# Altium schematic sheet Misc.SchDoc
size A4
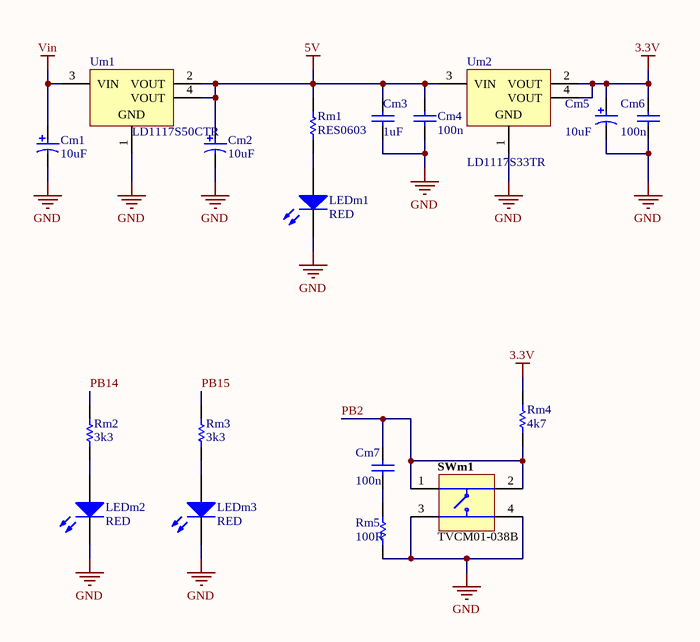
[diagram p0: Misc.SchDoc]

## Parts
Cm1  10uF  [CAPMP3217X18-T_V]
Cm2  10uF  [CAPMP3217X18-T_V]
Cm3  1uF  [CAPC0603(1608)100_L]
Cm4  100n  [CAPC0603(1608)100_L]
Cm5  10uF  [CAPMP3217X18-T_V]
Cm6  100n  [CAPC0603(1608)100_L]
Cm7  100n  [CAPC0603(1608)100_L]
LEDm1  RED  [0805_DIODE]
LEDm2  RED  [0805_DIODE]
LEDm3  RED  [0805_DIODE]
Rm1  RES0603  [RESC0603(1608)_L]
Rm2  3k3  [RESC0603(1608)_L]
Rm3  3k3  [RESC0603(1608)_L]
Rm4  4k7  [RESC0603(1608)_L]
Rm5  100R  [RESC0603(1608)_L]
SWm1  TVCM01-038B  [JNFU-TVCM01-038B_V]
Um1  LD1117S50CTR  [SOT-223_N]
Um2  LD1117S33TR  [SOT-223_L]

## Nets
3.3V: Cm5.1 Cm6.2 Rm4.2 Um2.2(VOUT) Um2.4(VOUT)
5V: Cm2.1 Cm3.2 Cm4.2 Rm1.2 Um1.2(VOUT) Um1.4(VOUT) Um2.3(VIN)
GND: Cm1.2 Cm2.2 Cm3.1 Cm4.1 Cm5.2 Cm6.1 LEDm1.2(K) LEDm2.2(K) LEDm3.2(K) Rm5.1 SWm1.3 SWm1.4 Um1.1(GND) Um2.1(GND)
Vin: Cm1.1 Um1.3(VIN)
PB2: Cm7.2 Rm4.1 SWm1.1 SWm1.2
PB14: Rm2.2
PB15: Rm3.2
NetCm7_1: Cm7.1 Rm5.2
NetLEDm1_1: LEDm1.1(A) Rm1.1
NetLEDm2_1: LEDm2.1(A) Rm2.1
NetLEDm3_1: LEDm3.1(A) Rm3.1

## Library data of the parts
Cm1 Cm2 Cm5 = CMP-1661-00003-1: Standard Tantalum, 1 uF, +/- 10%, 35 V, -55 to 125 degC, 2-Pin SMD (1206), RoHS, Tape and Reel; Current Rating: 200 mA; Voltage Rating (DC): 30 V; REACH SVHC: No SVHC; ComponentLink2URL: http://datasheets.avx.com/TAJ.pdf; Pins: 3; PackageReference: CAPMP3217X18-T; Width: 4 mm; ComponentLink3Description: Package Specification; Length: 11.6 mm; PackageDescription: 2-Pin Surface Mount Device, Body 3.2 x 1.65 mm; ComponentLink2Description: Datasheet; Max Operating Temperature: 70 degC; Contact Material: Copper; Contact Finish: Silver; DatasheetVersion: Feb-16; Contact Plating: Silver; Package Quantity: 1000; Height: 7.4 mm; Min Operating Temperature: -20 degC; Packaging: Bulk; RoHSCompliant: true; ComponentLink1URL: http://www.avx.com/; Mount: Through Hole; ComponentLink1Description: Manufacturer URL; ComponentLink3URL: http://www.avx.com/download/software/literature/AVX-Footprint-Library.pdf
Cm3 Cm4 Cm6 Cm7 = CMP-1590-00005-1: 0603 (1608 Metric) Chip Capacitor; Case-Metric: 1608; Case-EIA: 0603; PackageReference: CAPC0603(1608)100
LEDm1-LEDm3 = LED: Light-emitting diode; COLOR: RED
Rm1-Rm5 = CMP-1591-00001-1: 0603 (1608 Metric) Chip Resistor; Case-Metric: 1608; Case-EIA: 0603; PackageReference: RESC0603(1608)
SWm1 = CMP-0224-00001-1: Switch, Push Button, 50 mA, 12V DC, SMD; Mechanical Life: 100,000 cycles; PackageReference: TVCM01-038B; Operating Temperature: -30 to 85 degC; ComponentLink1URL: http://www.jian-fu.com/; ComponentLink2Description: Datasheet; Mounting Technology: Suface Mount; Case Size: 4.5 x 4.5; ComponentLink1Description: Manufacturer URL; PartNumber: TVCM01-038B; ComponentLink2URL: http://www.jian-fu.com/product-61.html; PackageDescription: 4-Pin Surface Mount Switch, 4.5 x 4.5 mm Body
Um1 = CMP-0244-00311-1: Fixed Low Drop Positive Voltage Regulator, 5V, 4-Pin SOT-223, Tape and Reel; PackageReference: SOT-223; PackageVersion: 2010; ComponentLink2URL: http://www.st.com/internet/com/TECHNICAL_RESOURCES/TECHNICAL_LITERATURE/DATASHEET/CD00000544.pdf; ComponentLink1URL: http://www.st.com; ComponentLink2Description: Datasheet; DatasheetVersion: 1/11/2011; ComponentLink1Description: Manufacturer URL; PackageDescription: 4-Pin SOT-223 Package, 6.5 x 3.5 mm Body, 2.3 mm Pitch, 7 mm Lead Span
Um2 = CMP-0244-00310-1: Fixed Low Drop Positive Voltage Regulator, 3.3V, 4-Pin SOT-223, Tape and Reel; ComponentLink2Description: Datasheet; PackageDescription: 4-Pin SOT-223 Package, 6.5 x 3.5 mm Body, 2.3 mm Pitch, 7 mm Lead Span; PackageVersion: 2010; ComponentLink2URL: http://www.st.com/internet/com/TECHNICAL_RESOURCES/TECHNICAL_LITERATURE/DATASHEET/CD00000544.pdf; PackageReference: SOT-223; DatasheetVersion: 1/11/2011; ComponentLink1Description: Manufacturer URL; ComponentLink1URL: http://www.st.com